# EAGLE schematic PCB_ROHM_BaAnh (EAGLE 9.6.2)
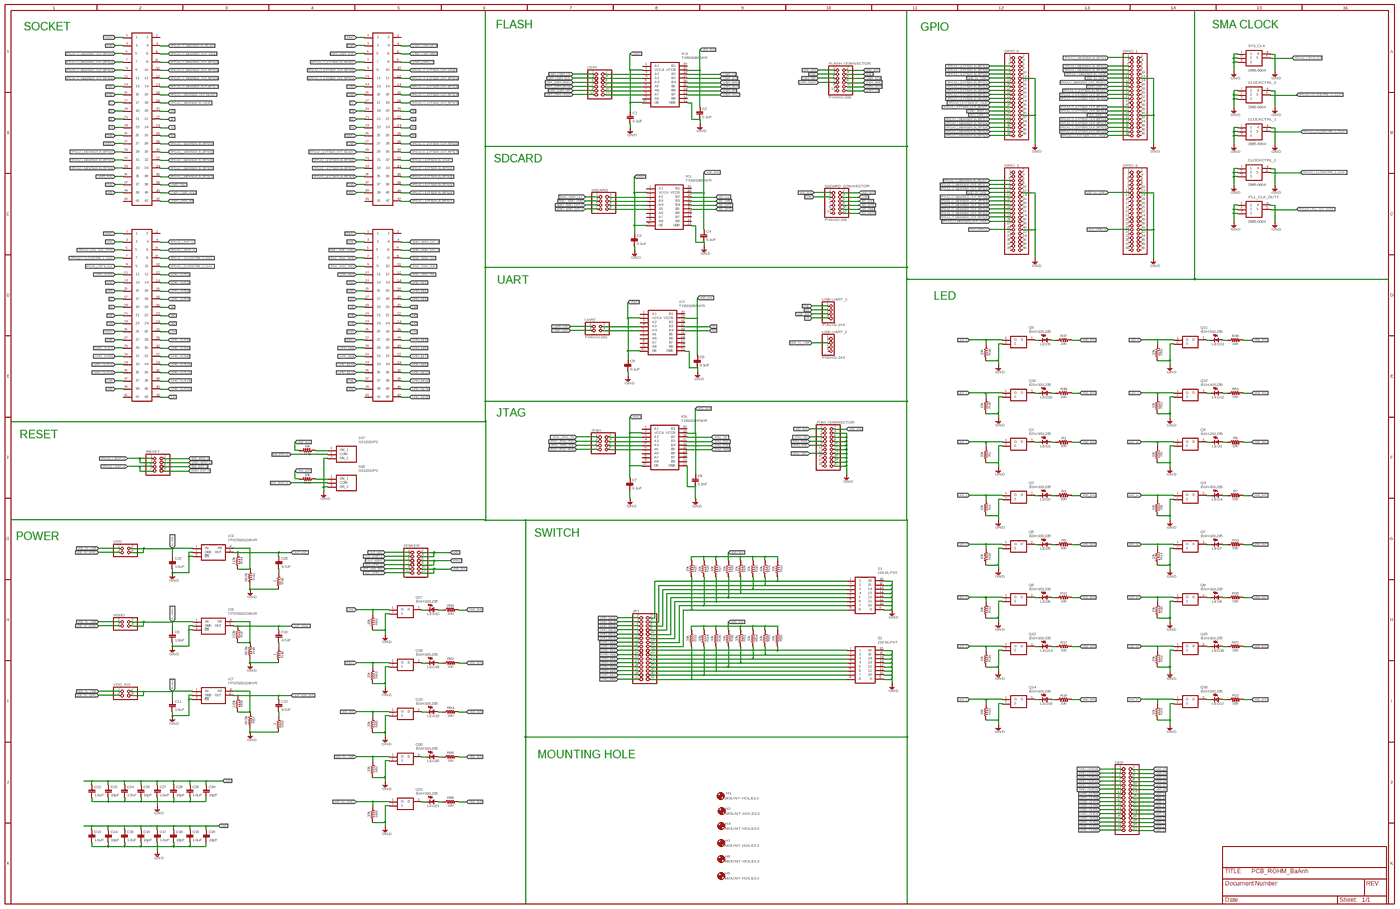
[diagram p0: schematic, sheet 1, overview]
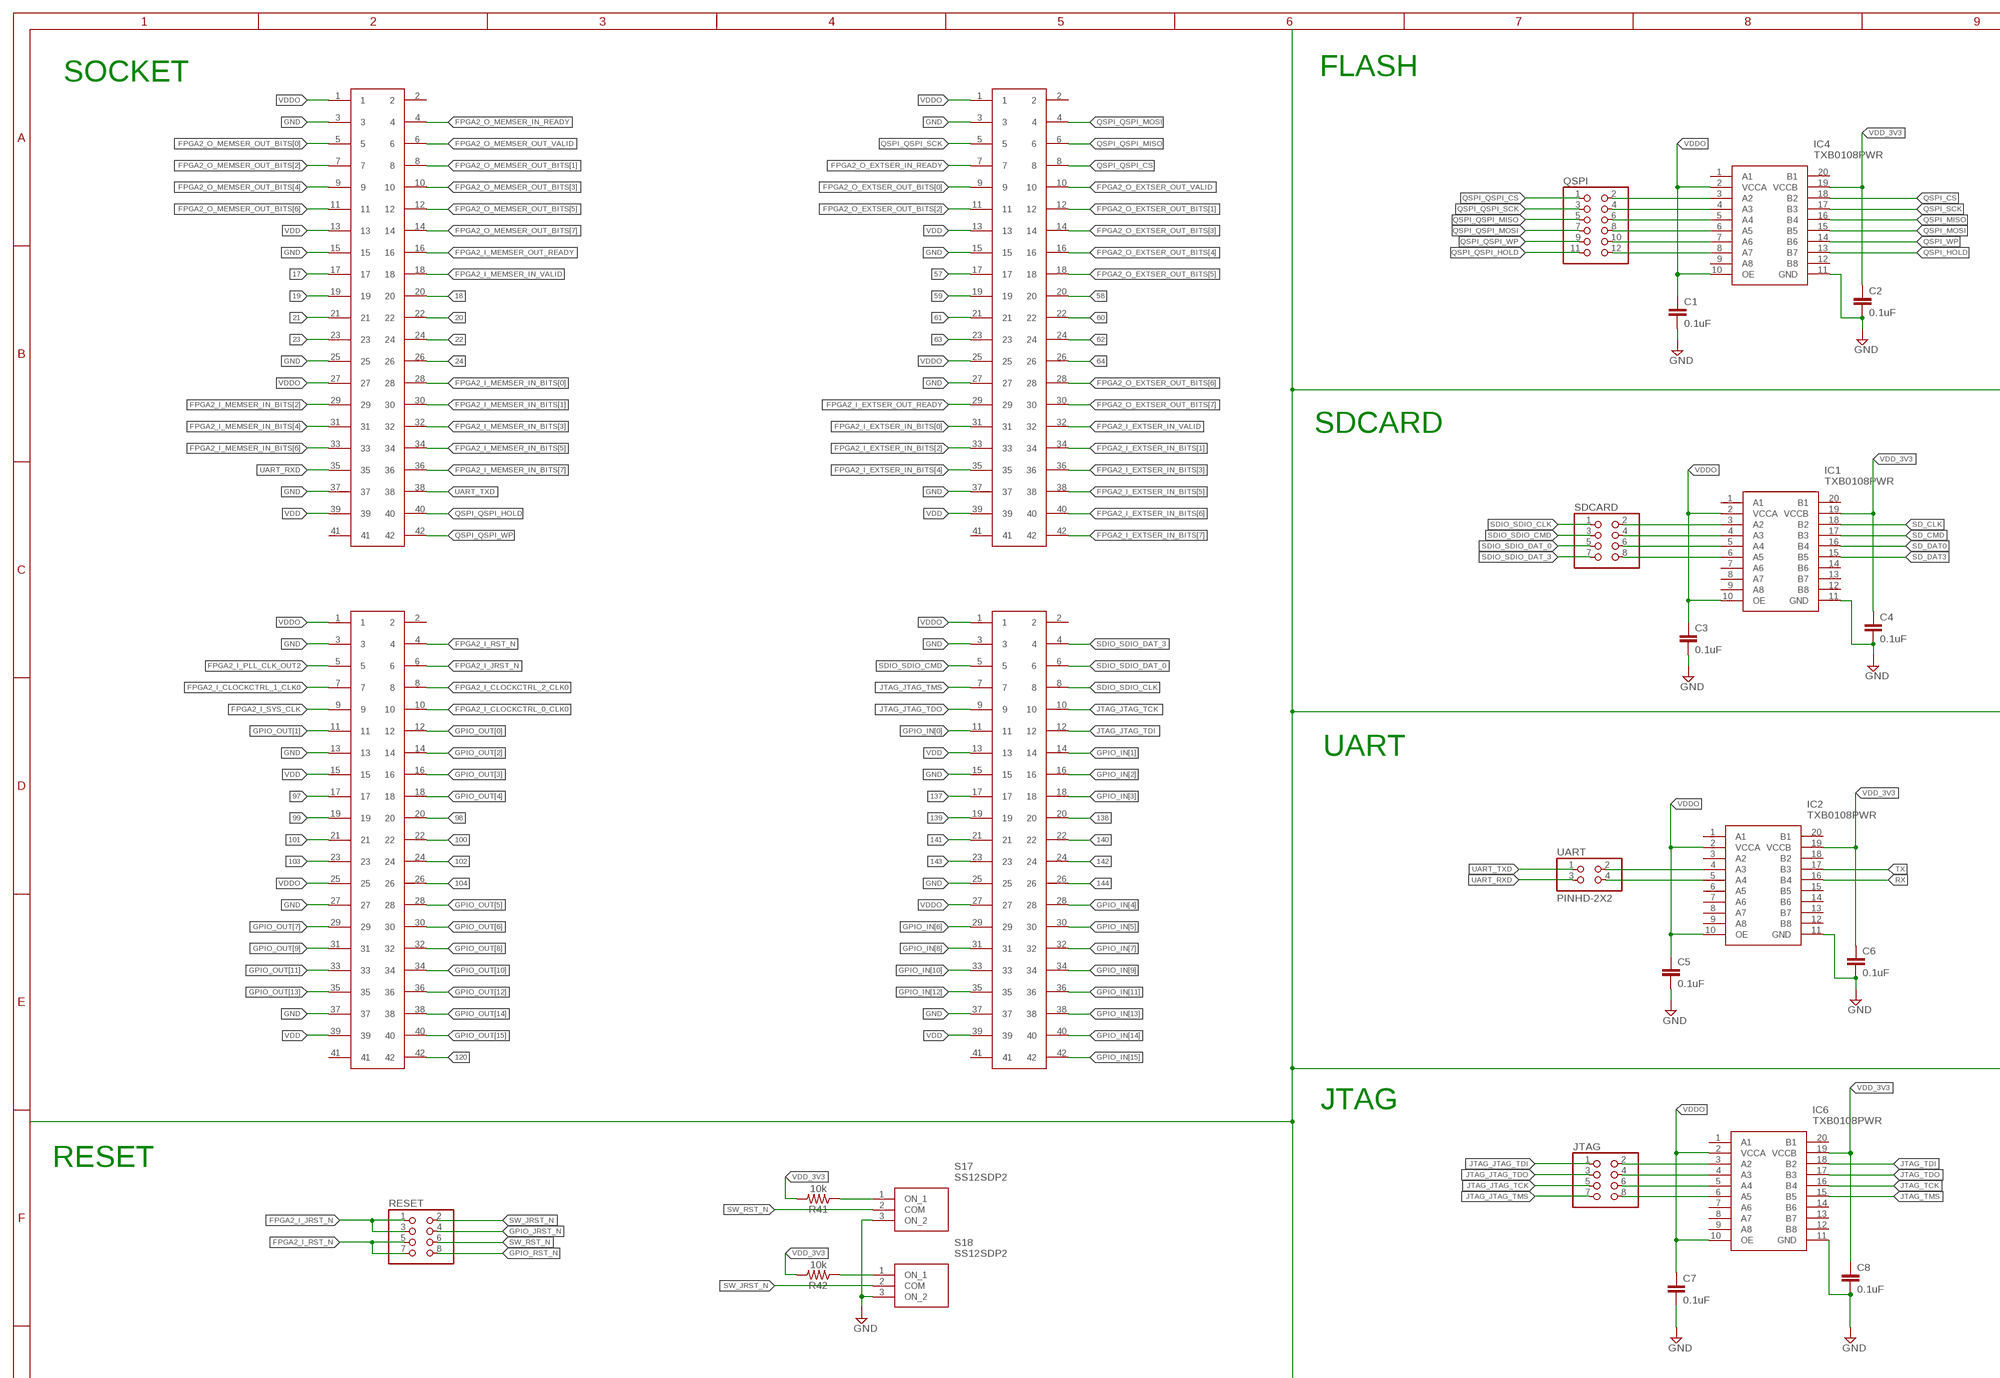
[diagram p1: schematic, sheet 1, part 1 of 4]
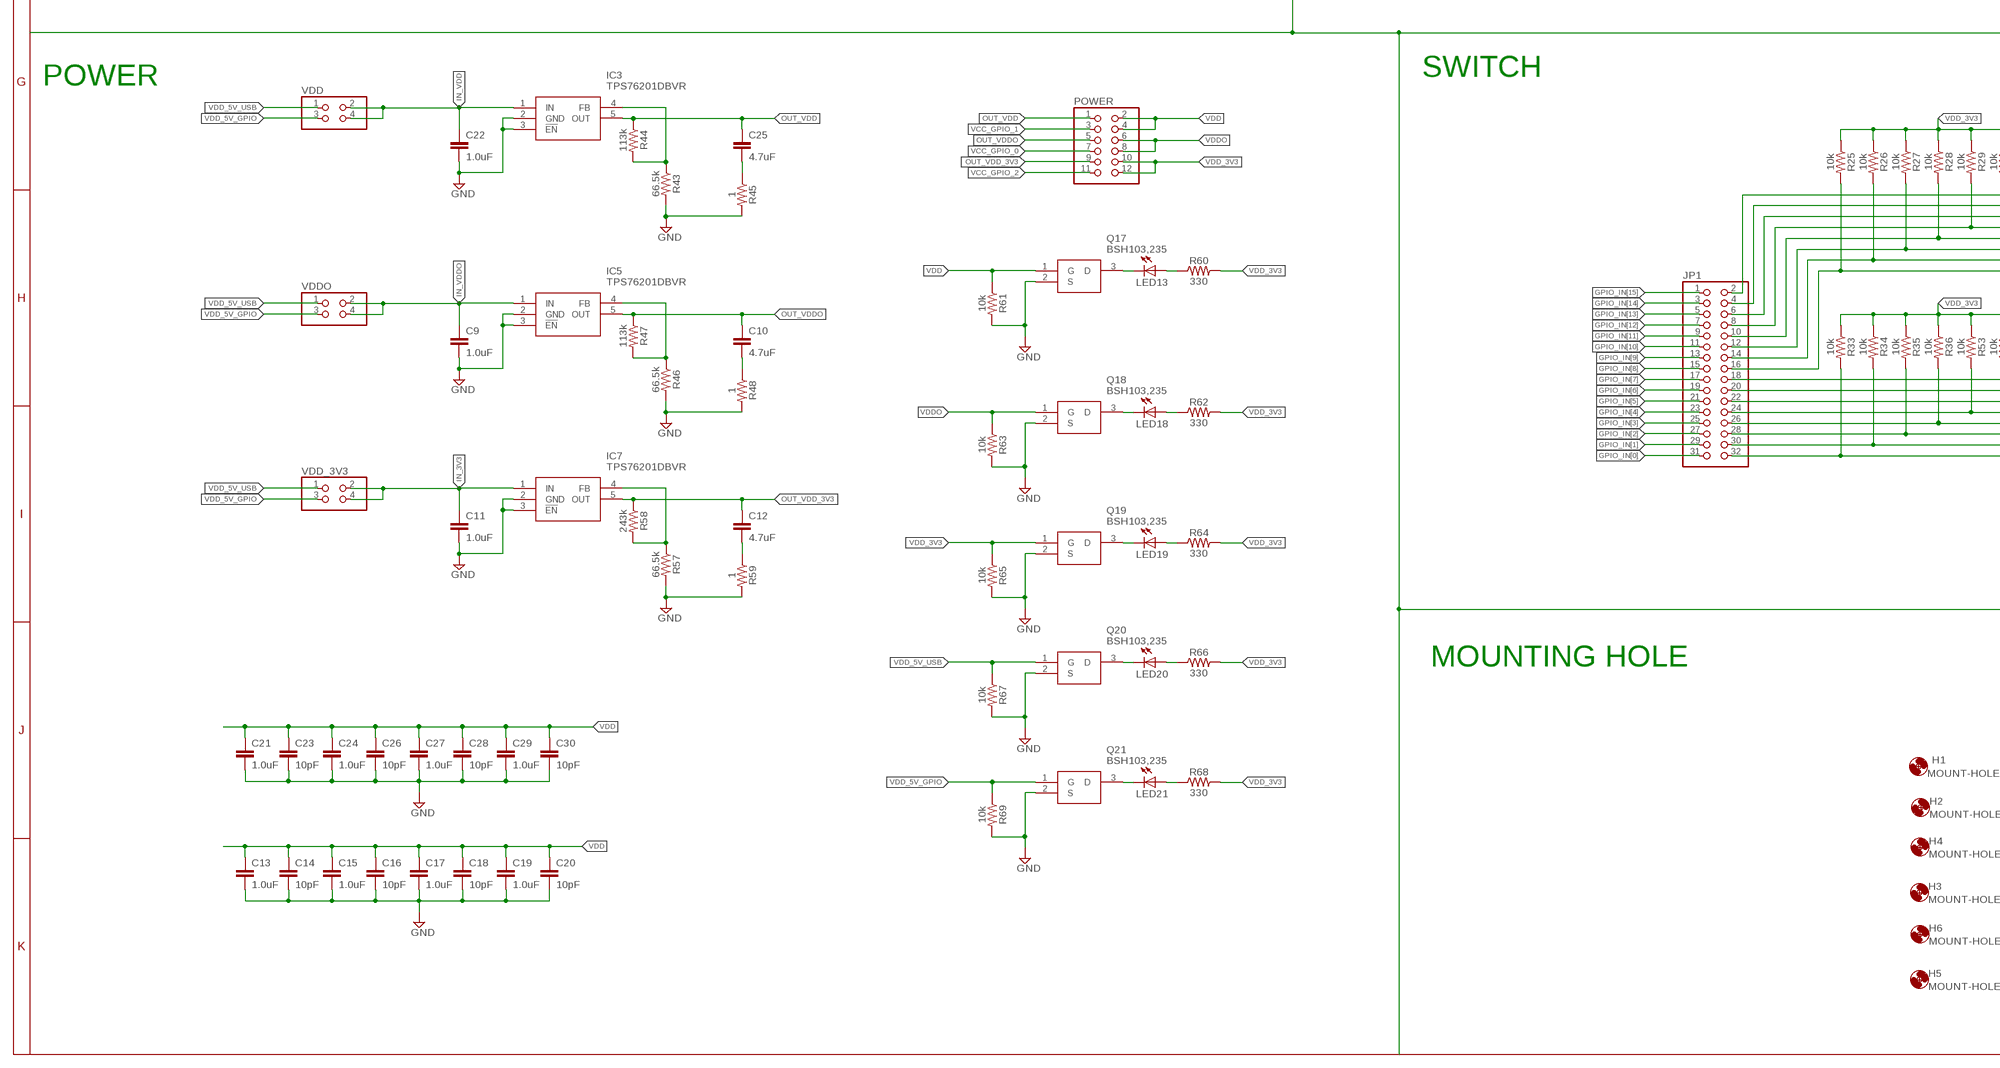
[diagram p2: schematic, sheet 1, part 2 of 4]
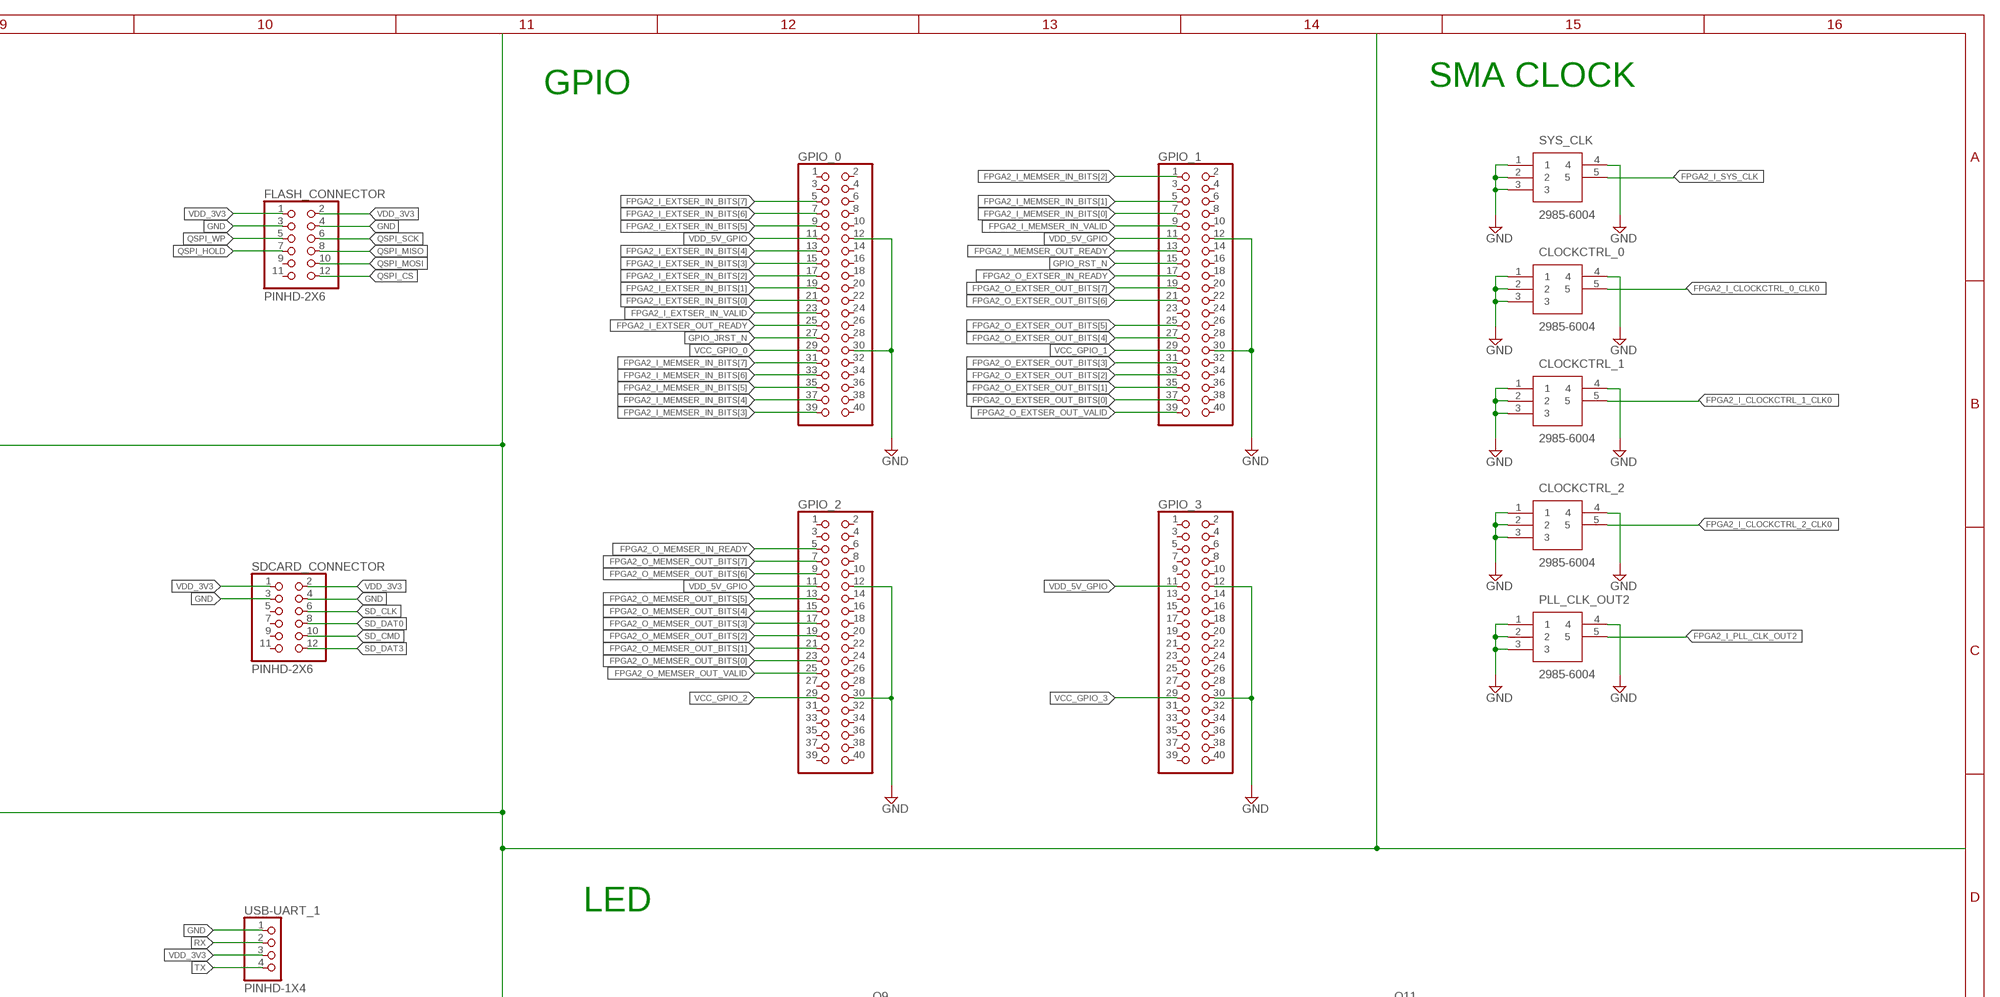
[diagram p3: schematic, sheet 1, part 3 of 4]
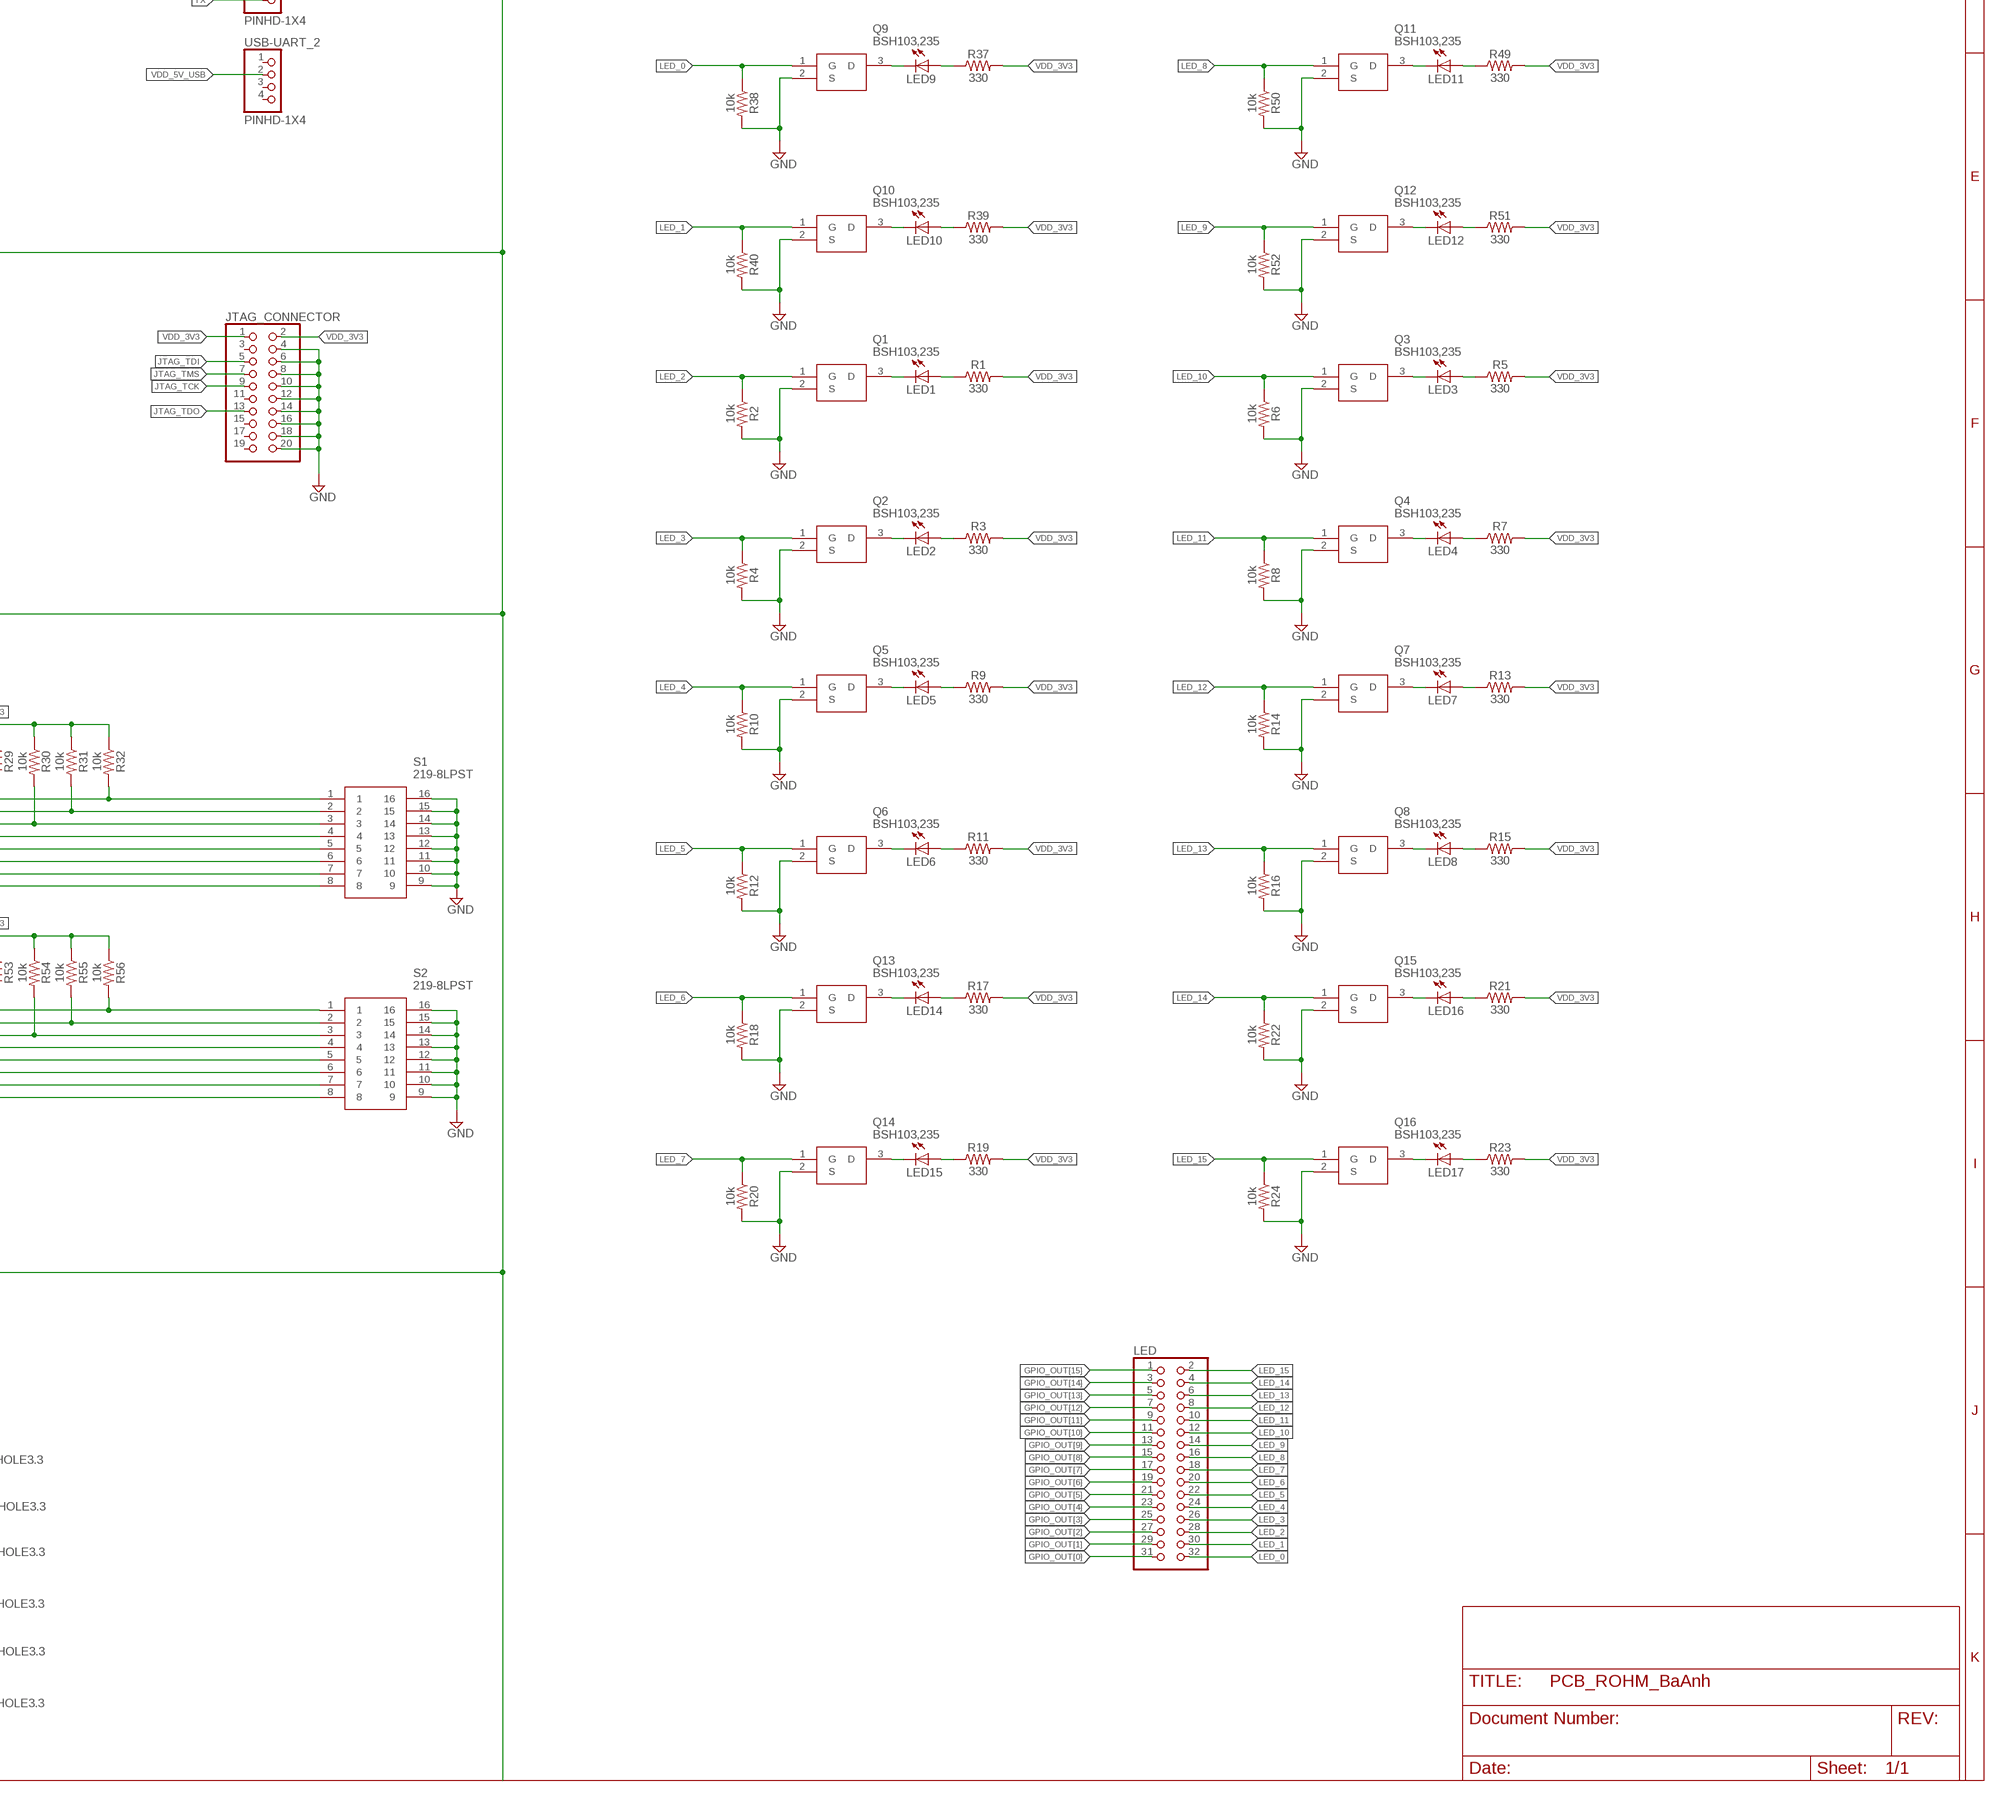
[diagram p4: schematic, sheet 1, part 4 of 4]

## Parts
C1  0.1uF  1.0UF-0805-25V-(+80/-20%)  [0805]
C2  0.1uF  1.0UF-0805-25V-(+80/-20%)  [0805]
C3  0.1uF  1.0UF-0805-25V-(+80/-20%)  [0805]
C4  0.1uF  1.0UF-0805-25V-(+80/-20%)  [0805]
C5  0.1uF  1.0UF-0805-25V-(+80/-20%)  [0805]
C6  0.1uF  1.0UF-0805-25V-(+80/-20%)  [0805]
C7  0.1uF  1.0UF-0805-25V-(+80/-20%)  [0805]
C8  0.1uF  1.0UF-0805-25V-(+80/-20%)  [0805]
C9  1.0uF  1.0UF-0805-25V-(+80/-20%)  [0805]
C10  4.7uF  1.0UF-0805-25V-(+80/-20%)  [0805]
C11  1.0uF  1.0UF-0805-25V-(+80/-20%)  [0805]
C12  4.7uF  1.0UF-0805-25V-(+80/-20%)  [0805]
C13  1.0uF  1.0UF-0805-25V-(+80/-20%)  [0805]
C14  10pF  1.0UF-0805-25V-(+80/-20%)  [0805]
C15  1.0uF  1.0UF-0805-25V-(+80/-20%)  [0805]
C16  10pF  1.0UF-0805-25V-(+80/-20%)  [0805]
C17  1.0uF  1.0UF-0805-25V-(+80/-20%)  [0805]
C18  10pF  1.0UF-0805-25V-(+80/-20%)  [0805]
C19  1.0uF  1.0UF-0805-25V-(+80/-20%)  [0805]
C20  10pF  1.0UF-0805-25V-(+80/-20%)  [0805]
C21  1.0uF  1.0UF-0805-25V-(+80/-20%)  [0805]
C22  1.0uF  1.0UF-0805-25V-(+80/-20%)  [0805]
C23  10pF  1.0UF-0805-25V-(+80/-20%)  [0805]
C24  1.0uF  1.0UF-0805-25V-(+80/-20%)  [0805]
C25  4.7uF  1.0UF-0805-25V-(+80/-20%)  [0805]
C26  10pF  1.0UF-0805-25V-(+80/-20%)  [0805]
C27  1.0uF  1.0UF-0805-25V-(+80/-20%)  [0805]
C28  10pF  1.0UF-0805-25V-(+80/-20%)  [0805]
C29  1.0uF  1.0UF-0805-25V-(+80/-20%)  [0805]
C30  10pF  1.0UF-0805-25V-(+80/-20%)  [0805]
CLOCKCTRL_0  2985-6004  [29856004]
CLOCKCTRL_1  2985-6004  [29856004]
CLOCKCTRL_2  2985-6004  [29856004]
FLASH_CONNECTOR  PINHD-2X6  [2X06]
GPIO_0  PINHD-2X20  [2X20]
GPIO_1  PINHD-2X20  [2X20]
GPIO_2  PINHD-2X20  [2X20]
GPIO_3  PINHD-2X20  [2X20]
H1  MOUNT-HOLE3.3  [3,3]
H2  MOUNT-HOLE3.3  [3,3]
H3  MOUNT-HOLE3.3  [3,3]
H4  MOUNT-HOLE3.3  [3,3]
H5  MOUNT-HOLE3.3  [3,3]
H6  MOUNT-HOLE3.3  [3,3]
IC1  TXB0108PWR  [SOP65P640X120-20N]
IC2  TXB0108PWR  [SOP65P640X120-20N]
IC3  TPS76201DBVR  [SOT95P280X145-5N]
IC4  TXB0108PWR  [SOP65P640X120-20N]
IC5  TPS76201DBVR  [SOT95P280X145-5N]
IC6  TXB0108PWR  [SOP65P640X120-20N]
IC7  TPS76201DBVR  [SOT95P280X145-5N]
JP1  PINHD-2X16  [2X16]
JTAG  PINHD-2X4  [2X04]
JTAG_CONNECTOR  PINHD-2X10  [2X10]
LED  PINHD-2X16  [2X16]
LED1  LEDCHIP-LED0805  [CHIP-LED0805]
LED2  LEDCHIP-LED0805  [CHIP-LED0805]
LED3  LEDCHIP-LED0805  [CHIP-LED0805]
LED4  LEDCHIP-LED0805  [CHIP-LED0805]
LED5  LEDCHIP-LED0805  [CHIP-LED0805]
LED6  LEDCHIP-LED0805  [CHIP-LED0805]
LED7  LEDCHIP-LED0805  [CHIP-LED0805]
LED8  LEDCHIP-LED0805  [CHIP-LED0805]
LED9  LEDCHIP-LED0805  [CHIP-LED0805]
LED10  LEDCHIP-LED0805  [CHIP-LED0805]
LED11  LEDCHIP-LED0805  [CHIP-LED0805]
LED12  LEDCHIP-LED0805  [CHIP-LED0805]
LED13  LEDCHIP-LED0805  [CHIP-LED0805]
LED14  LEDCHIP-LED0805  [CHIP-LED0805]
LED15  LEDCHIP-LED0805  [CHIP-LED0805]
LED16  LEDCHIP-LED0805  [CHIP-LED0805]
LED17  LEDCHIP-LED0805  [CHIP-LED0805]
LED18  LEDCHIP-LED0805  [CHIP-LED0805]
LED19  LEDCHIP-LED0805  [CHIP-LED0805]
LED20  LEDCHIP-LED0805  [CHIP-LED0805]
LED21  LEDCHIP-LED0805  [CHIP-LED0805]
PLL_CLK_OUT2  2985-6004  [29856004]
POWER  PINHD-2X6  [2X06]
Q1  BSH103,235  [SOT95P230X110-3N]
Q2  BSH103,235  [SOT95P230X110-3N]
Q3  BSH103,235  [SOT95P230X110-3N]
Q4  BSH103,235  [SOT95P230X110-3N]
Q5  BSH103,235  [SOT95P230X110-3N]
Q6  BSH103,235  [SOT95P230X110-3N]
Q7  BSH103,235  [SOT95P230X110-3N]
Q8  BSH103,235  [SOT95P230X110-3N]
Q9  BSH103,235  [SOT95P230X110-3N]
Q10  BSH103,235  [SOT95P230X110-3N]
Q11  BSH103,235  [SOT95P230X110-3N]
Q12  BSH103,235  [SOT95P230X110-3N]
Q13  BSH103,235  [SOT95P230X110-3N]
Q14  BSH103,235  [SOT95P230X110-3N]
Q15  BSH103,235  [SOT95P230X110-3N]
Q16  BSH103,235  [SOT95P230X110-3N]
Q17  BSH103,235  [SOT95P230X110-3N]
Q18  BSH103,235  [SOT95P230X110-3N]
Q19  BSH103,235  [SOT95P230X110-3N]
Q20  BSH103,235  [SOT95P230X110-3N]
Q21  BSH103,235  [SOT95P230X110-3N]
QSPI  PINHD-2X6  [2X06]
R1  330  0.3OHM-0805-1/8W-1%  [0805]
R2  10k  0.3OHM-0805-1/8W-1%  [0805]
R3  330  0.3OHM-0805-1/8W-1%  [0805]
R4  10k  0.3OHM-0805-1/8W-1%  [0805]
R5  330  0.3OHM-0805-1/8W-1%  [0805]
R6  10k  0.3OHM-0805-1/8W-1%  [0805]
R7  330  0.3OHM-0805-1/8W-1%  [0805]
R8  10k  0.3OHM-0805-1/8W-1%  [0805]
R9  330  0.3OHM-0805-1/8W-1%  [0805]
R10  10k  0.3OHM-0805-1/8W-1%  [0805]
R11  330  0.3OHM-0805-1/8W-1%  [0805]
R12  10k  0.3OHM-0805-1/8W-1%  [0805]
R13  330  0.3OHM-0805-1/8W-1%  [0805]
R14  10k  0.3OHM-0805-1/8W-1%  [0805]
R15  330  0.3OHM-0805-1/8W-1%  [0805]
R16  10k  0.3OHM-0805-1/8W-1%  [0805]
R17  330  0.3OHM-0805-1/8W-1%  [0805]
R18  10k  0.3OHM-0805-1/8W-1%  [0805]
R19  330  0.3OHM-0805-1/8W-1%  [0805]
R20  10k  0.3OHM-0805-1/8W-1%  [0805]
R21  330  0.3OHM-0805-1/8W-1%  [0805]
R22  10k  0.3OHM-0805-1/8W-1%  [0805]
R23  330  0.3OHM-0805-1/8W-1%  [0805]
R24  10k  0.3OHM-0805-1/8W-1%  [0805]
R25  10k  0.3OHM-0805-1/8W-1%  [0805]
R26  10k  0.3OHM-0805-1/8W-1%  [0805]
R27  10k  0.3OHM-0805-1/8W-1%  [0805]
R28  10k  0.3OHM-0805-1/8W-1%  [0805]
R29  10k  0.3OHM-0805-1/8W-1%  [0805]
R30  10k  0.3OHM-0805-1/8W-1%  [0805]
R31  10k  0.3OHM-0805-1/8W-1%  [0805]
R32  10k  0.3OHM-0805-1/8W-1%  [0805]
R33  10k  0.3OHM-0805-1/8W-1%  [0805]
R34  10k  0.3OHM-0805-1/8W-1%  [0805]
R35  10k  0.3OHM-0805-1/8W-1%  [0805]
R36  10k  0.3OHM-0805-1/8W-1%  [0805]
R37  330  0.3OHM-0805-1/8W-1%  [0805]
R38  10k  0.3OHM-0805-1/8W-1%  [0805]
R39  330  0.3OHM-0805-1/8W-1%  [0805]
R40  10k  0.3OHM-0805-1/8W-1%  [0805]
R41  10k  0.3OHM-0805-1/8W-1%  [0805]
R42  10k  0.3OHM-0805-1/8W-1%  [0805]
R43  66.5k  0.3OHM-0805-1/8W-1%  [0805]
R44  113k  0.3OHM-0805-1/8W-1%  [0805]
R45  1  0.3OHM-0805-1/8W-1%  [0805]
R46  66.5k  0.3OHM-0805-1/8W-1%  [0805]
R47  113k  0.3OHM-0805-1/8W-1%  [0805]
R48  1  0.3OHM-0805-1/8W-1%  [0805]
R49  330  0.3OHM-0805-1/8W-1%  [0805]
R50  10k  0.3OHM-0805-1/8W-1%  [0805]
R51  330  0.3OHM-0805-1/8W-1%  [0805]
R52  10k  0.3OHM-0805-1/8W-1%  [0805]
R53  10k  0.3OHM-0805-1/8W-1%  [0805]
R54  10k  0.3OHM-0805-1/8W-1%  [0805]
R55  10k  0.3OHM-0805-1/8W-1%  [0805]
R56  10k  0.3OHM-0805-1/8W-1%  [0805]
R57  66.5k  0.3OHM-0805-1/8W-1%  [0805]
R58  243k  0.3OHM-0805-1/8W-1%  [0805]
R59  1  0.3OHM-0805-1/8W-1%  [0805]
R60  330  0.3OHM-0805-1/8W-1%  [0805]
R61  10k  0.3OHM-0805-1/8W-1%  [0805]
R62  330  0.3OHM-0805-1/8W-1%  [0805]
R63  10k  0.3OHM-0805-1/8W-1%  [0805]
R64  330  0.3OHM-0805-1/8W-1%  [0805]
R65  10k  0.3OHM-0805-1/8W-1%  [0805]
R66  330  0.3OHM-0805-1/8W-1%  [0805]
R67  10k  0.3OHM-0805-1/8W-1%  [0805]
R68  330  0.3OHM-0805-1/8W-1%  [0805]
R69  10k  0.3OHM-0805-1/8W-1%  [0805]
RESET  PINHD-2X4  [2X04]
S1  219-8LPST  [2198LPST]
S2  219-8LPST  [2198LPST]
S17  SS12SDP2  [SS12SDP2]
S18  SS12SDP2  [SS12SDP2]
SDCARD  PINHD-2X4  [2X04]
SDCARD_CONNECTOR  PINHD-2X6  [2X06]
SYS_CLK  2985-6004  [29856004]
U$1  2X41_HEADER  [2X41_HEADER]
U$2  2X41_HEADER  [2X41_HEADER]
U$3  2X41_HEADER  [2X41_HEADER]
U$4  2X41_HEADER  [2X41_HEADER]
UART  PINHD-2X2  [2X02]
USB-UART_1  PINHD-1X4  [1X04]
USB-UART_2  PINHD-1X4  [1X04]
VDD  PINHD-2X2  [2X02]
VDD_3V3  PINHD-2X2  [2X02]
VDDO  PINHD-2X2  [2X02]

## Nets
17: U$1.17
18: U$1.20
19: U$1.19
20: U$1.22
21: U$1.21
22: U$1.24
23: U$1.23
24: U$1.26
57: U$2.17
58: U$2.20
59: U$2.19
60: U$2.22
61: U$2.21
62: U$2.24
63: U$2.23
64: U$2.26
97: U$3.17
98: U$3.20
99: U$3.19
100: U$3.22
101: U$3.21
102: U$3.24
103: U$3.23
104: U$3.26
120: U$3.42
137: U$4.17
138: U$4.20
139: U$4.19
140: U$4.22
141: U$4.21
142: U$4.24
143: U$4.23
144: U$4.26
FPGA2_I_CLOCKCTRL_0_CLK0: CLOCKCTRL_0.5 U$3.10
FPGA2_I_CLOCKCTRL_1_CLK0: CLOCKCTRL_1.5 U$3.7
FPGA2_I_CLOCKCTRL_2_CLK0: CLOCKCTRL_2.5 U$3.8
FPGA2_I_EXTSER_IN_BITS[0]: GPIO_0.21 U$2.31
FPGA2_I_EXTSER_IN_BITS[1]: GPIO_0.19 U$2.34
FPGA2_I_EXTSER_IN_BITS[2]: GPIO_0.17 U$2.33
FPGA2_I_EXTSER_IN_BITS[3]: GPIO_0.15 U$2.36
FPGA2_I_EXTSER_IN_BITS[4]: GPIO_0.13 U$2.35
FPGA2_I_EXTSER_IN_BITS[5]: GPIO_0.9 U$2.38
FPGA2_I_EXTSER_IN_BITS[6]: GPIO_0.7 U$2.40
FPGA2_I_EXTSER_IN_BITS[7]: GPIO_0.5 U$2.42
FPGA2_I_EXTSER_IN_VALID: GPIO_0.23 U$2.32
FPGA2_I_EXTSER_OUT_READY: GPIO_0.25 U$2.29
FPGA2_I_JRST_N: RESET.1 RESET.3 U$3.6
FPGA2_I_MEMSER_IN_BITS[0]: GPIO_1.7 U$1.28
FPGA2_I_MEMSER_IN_BITS[1]: GPIO_1.5 U$1.30
FPGA2_I_MEMSER_IN_BITS[2]: GPIO_1.1 U$1.29
FPGA2_I_MEMSER_IN_BITS[3]: GPIO_0.39 U$1.32
FPGA2_I_MEMSER_IN_BITS[4]: GPIO_0.37 U$1.31
FPGA2_I_MEMSER_IN_BITS[5]: GPIO_0.35 U$1.34
FPGA2_I_MEMSER_IN_BITS[6]: GPIO_0.33 U$1.33
FPGA2_I_MEMSER_IN_BITS[7]: GPIO_0.31 U$1.36
FPGA2_I_MEMSER_IN_VALID: GPIO_1.9 U$1.18
FPGA2_I_MEMSER_OUT_READY: GPIO_1.13 U$1.16
FPGA2_I_PLL_CLK_OUT2: PLL_CLK_OUT2.5 U$3.5
FPGA2_I_RST_N: RESET.5 RESET.7 U$3.4
FPGA2_I_SYS_CLK: SYS_CLK.5 U$3.9
FPGA2_O_EXTSER_IN_READY: GPIO_1.17 U$2.7
FPGA2_O_EXTSER_OUT_BITS[0]: GPIO_1.37 U$2.9
FPGA2_O_EXTSER_OUT_BITS[1]: GPIO_1.35 U$2.12
FPGA2_O_EXTSER_OUT_BITS[2]: GPIO_1.33 U$2.11
FPGA2_O_EXTSER_OUT_BITS[3]: GPIO_1.31 U$2.14
FPGA2_O_EXTSER_OUT_BITS[4]: GPIO_1.27 U$2.16
FPGA2_O_EXTSER_OUT_BITS[5]: GPIO_1.25 U$2.18
FPGA2_O_EXTSER_OUT_BITS[6]: GPIO_1.21 U$2.28
FPGA2_O_EXTSER_OUT_BITS[7]: GPIO_1.19 U$2.30
FPGA2_O_EXTSER_OUT_VALID: GPIO_1.39 U$2.10
FPGA2_O_MEMSER_IN_READY: GPIO_2.5 U$1.4
FPGA2_O_MEMSER_OUT_BITS[0]: GPIO_2.23 U$1.5
FPGA2_O_MEMSER_OUT_BITS[1]: GPIO_2.21 U$1.8
FPGA2_O_MEMSER_OUT_BITS[2]: GPIO_2.19 U$1.7
FPGA2_O_MEMSER_OUT_BITS[3]: GPIO_2.17 U$1.10
FPGA2_O_MEMSER_OUT_BITS[4]: GPIO_2.15 U$1.9
FPGA2_O_MEMSER_OUT_BITS[5]: GPIO_2.13 U$1.12
FPGA2_O_MEMSER_OUT_BITS[6]: GPIO_2.9 U$1.11
FPGA2_O_MEMSER_OUT_BITS[7]: GPIO_2.7 U$1.14
FPGA2_O_MEMSER_OUT_VALID: GPIO_2.25 U$1.6
GND: C1.2 C2.2 C3.2 C4.2 C5.2 C6.2 C7.2 C8.2 C9.2 C11.2 C13.2 C14.2 C15.2 C16.2 C17.2 C18.2 C19.2 C20.2 C21.2 C22.2 C23.2 C24.2 C26.2 C27.2 C28.2 C29.2 C30.2 CLOCKCTRL_0.1 CLOCKCTRL_0.2 CLOCKCTRL_0.3 CLOCKCTRL_0.4 CLOCKCTRL_1.1 CLOCKCTRL_1.2 CLOCKCTRL_1.3 CLOCKCTRL_1.4 CLOCKCTRL_2.1 CLOCKCTRL_2.2 CLOCKCTRL_2.3 CLOCKCTRL_2.4 FLASH_CONNECTOR.3 FLASH_CONNECTOR.4 GPIO_0.12 GPIO_0.30 GPIO_1.12 GPIO_1.30 GPIO_2.12 GPIO_2.30 GPIO_3.12 GPIO_3.30 IC1.11(GND) IC2.11(GND) IC3.2(GND) IC3.3(!EN) IC4.11(GND) IC5.2(GND) IC5.3(!EN) IC6.11(GND) IC7.2(GND) IC7.3(!EN) JTAG_CONNECTOR.4 JTAG_CONNECTOR.6 JTAG_CONNECTOR.8 JTAG_CONNECTOR.10 JTAG_CONNECTOR.12 JTAG_CONNECTOR.14 JTAG_CONNECTOR.16 JTAG_CONNECTOR.18 JTAG_CONNECTOR.20 PLL_CLK_OUT2.1 PLL_CLK_OUT2.2 PLL_CLK_OUT2.3 PLL_CLK_OUT2.4 Q1.2(S) Q2.2(S) Q3.2(S) Q4.2(S) Q5.2(S) Q6.2(S) Q7.2(S) Q8.2(S) Q9.2(S) Q10.2(S) Q11.2(S) Q12.2(S) Q13.2(S) Q14.2(S) Q15.2(S) Q16.2(S) Q17.2(S) Q18.2(S) Q19.2(S) Q20.2(S) Q21.2(S) R2.2 R4.2 R6.2 R8.2 R10.2 R12.2 R14.2 R16.2 R18.2 R20.2 R22.2 R24.2 R38.2 R40.2 R43.2 R45.2 R46.2 R48.2 R50.2 R52.2 R57.2 R59.2 R61.2 R63.2 R65.2 R67.2 R69.2 S1.9 S1.10 S1.11 S1.12 S1.13 S1.14 S1.15 S1.16 S2.9 S2.10 S2.11 S2.12 S2.13 S2.14 S2.15 S2.16 S17.3(ON_2) S18.3(ON_2) SDCARD_CONNECTOR.3 SDCARD_CONNECTOR.4 SYS_CLK.1 SYS_CLK.2 SYS_CLK.3 SYS_CLK.4 U$1.3 U$1.15 U$1.25 U$1.37 U$2.3 U$2.15 U$2.27 U$2.37 U$3.3 U$3.13 U$3.27 U$3.37 U$4.3 U$4.15 U$4.25 U$4.37 USB-UART_1.1
GPIO_IN[0]: JP1.31 U$4.11
GPIO_IN[1]: JP1.29 U$4.14
GPIO_IN[2]: JP1.27 U$4.16
GPIO_IN[3]: JP1.25 U$4.18
GPIO_IN[4]: JP1.23 U$4.28
GPIO_IN[5]: JP1.21 U$4.30
GPIO_IN[6]: JP1.19 U$4.29
GPIO_IN[7]: JP1.17 U$4.32
GPIO_IN[8]: JP1.15 U$4.31
GPIO_IN[9]: JP1.13 U$4.34
GPIO_IN[10]: JP1.11 U$4.33
GPIO_IN[11]: JP1.9 U$4.36
GPIO_IN[12]: JP1.7 U$4.35
GPIO_IN[13]: JP1.5 U$4.38
GPIO_IN[14]: JP1.3 U$4.40
GPIO_IN[15]: JP1.1 U$4.42
GPIO_JRST_N: GPIO_0.27 RESET.4
GPIO_OUT[0]: LED.31 U$3.12
GPIO_OUT[1]: LED.29 U$3.11
GPIO_OUT[2]: LED.27 U$3.14
GPIO_OUT[3]: LED.25 U$3.16
GPIO_OUT[4]: LED.23 U$3.18
GPIO_OUT[5]: LED.21 U$3.28
GPIO_OUT[6]: LED.19 U$3.30
GPIO_OUT[7]: LED.17 U$3.29
GPIO_OUT[8]: LED.15 U$3.32
GPIO_OUT[9]: LED.13 U$3.31
GPIO_OUT[10]: LED.11 U$3.34
GPIO_OUT[11]: LED.9 U$3.33
GPIO_OUT[12]: LED.7 U$3.36
GPIO_OUT[13]: LED.5 U$3.35
GPIO_OUT[14]: LED.3 U$3.38
GPIO_OUT[15]: LED.1 U$3.40
GPIO_RST_N: GPIO_1.15 RESET.8
IN_3V3: C11.1 IC7.1(IN) VDD_3V3.2 VDD_3V3.4
IN_VDD: C22.1 IC3.1(IN) VDD.2 VDD.4
IN_VDDO: C9.1 IC5.1(IN) VDDO.2 VDDO.4
JTAG_JTAG_TCK: JTAG.5 U$4.10
JTAG_JTAG_TDI: JTAG.1 U$4.12
JTAG_JTAG_TDO: JTAG.3 U$4.9
JTAG_JTAG_TMS: JTAG.7 U$4.7
JTAG_TCK: IC6.16(B4) JTAG_CONNECTOR.9
JTAG_TDI: IC6.18(B2) JTAG_CONNECTOR.5
JTAG_TDO: IC6.17(B3) JTAG_CONNECTOR.13
JTAG_TMS: IC6.15(B5) JTAG_CONNECTOR.7
LED_0: LED.32 Q9.1(G) R38.1
LED_1: LED.30 Q10.1(G) R40.1
LED_2: LED.28 Q1.1(G) R2.1
LED_3: LED.26 Q2.1(G) R4.1
LED_4: LED.24 Q5.1(G) R10.1
LED_5: LED.22 Q6.1(G) R12.1
LED_6: LED.20 Q13.1(G) R18.1
LED_7: LED.18 Q14.1(G) R20.1
LED_8: LED.16 Q11.1(G) R50.1
LED_9: LED.14 Q12.1(G) R52.1
LED_10: LED.12 Q3.1(G) R6.1
LED_11: LED.10 Q4.1(G) R8.1
LED_12: LED.8 Q7.1(G) R14.1
LED_13: LED.6 Q8.1(G) R16.1
LED_14: LED.4 Q15.1(G) R22.1
LED_15: LED.2 Q16.1(G) R24.1
N$1: IC1.3(A2) SDCARD.2
N$2: IC1.4(A3) SDCARD.4
N$3: IC1.5(A4) SDCARD.6
N$4: IC1.6(A5) SDCARD.8
N$5: IC6.3(A2) JTAG.2
N$6: IC2.4(A3) UART.2
N$7: IC2.5(A4) UART.4
N$8: IC6.4(A3) JTAG.4
N$9: IC6.5(A4) JTAG.6
N$10: IC6.6(A5) JTAG.8
N$11: R41.1 S17.1(ON_1)
N$12: LED1.C Q1.3(D)
N$13: LED1.A R1.1
N$14: LED2.C Q2.3(D)
N$15: LED9.C Q9.3(D)
N$16: LED9.A R37.1
N$17: LED2.A R3.1
N$18: LED3.C Q3.3(D)
N$19: LED3.A R5.1
N$20: LED4.C Q4.3(D)
N$21: LED4.A R7.1
N$22: LED5.C Q5.3(D)
N$23: LED5.A R9.1
N$24: LED6.C Q6.3(D)
N$25: LED6.A R11.1
N$26: LED7.C Q7.3(D)
N$27: LED7.A R13.1
N$28: LED8.C Q8.3(D)
N$29: IC4.3(A2) QSPI.2
N$30: LED10.C Q10.3(D)
N$31: LED8.A R15.1
N$32: LED14.C Q13.3(D)
N$33: LED10.A R39.1
N$34: LED14.A R17.1
N$35: IC4.4(A3) QSPI.4
N$36: LED15.C Q14.3(D)
N$37: IC4.5(A4) QSPI.6
N$38: IC4.6(A5) QSPI.8
N$39: LED15.A R19.1
N$40: LED16.C Q15.3(D)
N$41: LED16.A R21.1
N$42: LED17.C Q16.3(D)
N$43: LED17.A R23.1
N$44: R42.1 S18.1(ON_1)
N$45: IC3.4(FB) R43.1 R44.2
N$46: C25.2 R45.1
N$47: IC5.4(FB) R46.1 R47.2
N$48: JP1.32 R33.2 S2.8
N$49: JP1.30 R34.2 S2.7
N$50: JP1.28 R35.2 S2.6
N$51: JP1.26 R36.2 S2.5
N$52: C10.2 R48.1
N$53: IC7.4(FB) R57.1 R58.2
N$54: C12.2 R59.1
N$55: LED13.C Q17.3(D)
N$56: JP1.24 R53.2 S2.4
N$57: JP1.22 R54.2 S2.3
N$58: JP1.20 R55.2 S2.2
N$59: LED11.C Q11.3(D)
N$60: JP1.18 R56.2 S2.1
N$61: LED11.A R49.1
N$62: LED13.A R60.1
N$63: LED12.C Q12.3(D)
N$64: LED12.A R51.1
N$65: LED18.C Q18.3(D)
N$66: JP1.16 R25.2 S1.8
N$67: JP1.14 R26.2 S1.7
N$68: JP1.12 R27.2 S1.6
N$69: JP1.10 R28.2 S1.5
N$70: LED18.A R62.1
N$71: LED19.C Q19.3(D)
N$72: JP1.8 R29.2 S1.4
N$73: JP1.6 R30.2 S1.3
N$74: JP1.4 R31.2 S1.2
N$75: JP1.2 R32.2 S1.1
N$76: LED19.A R64.1
N$77: LED20.C Q20.3(D)
N$78: LED20.A R66.1
N$79: LED21.C Q21.3(D)
N$80: IC4.7(A6) QSPI.10
N$81: IC4.8(A7) QSPI.12
N$82: LED21.A R68.1
OUT_VDD: C25.1 IC3.5(OUT) POWER.1 R44.1
OUT_VDD_3V3: C12.1 IC7.5(OUT) POWER.9 R58.1
OUT_VDDO: C10.1 IC5.5(OUT) POWER.5 R47.1
QSPI_CS: FLASH_CONNECTOR.12 IC4.18(B2)
QSPI_HOLD: FLASH_CONNECTOR.7 IC4.13(B7)
QSPI_MISO: FLASH_CONNECTOR.8 IC4.16(B4)
QSPI_MOSI: FLASH_CONNECTOR.10 IC4.15(B5)
QSPI_QSPI_CS: QSPI.1 U$2.8
QSPI_QSPI_HOLD: QSPI.11 U$1.40
QSPI_QSPI_MISO: QSPI.5 U$2.6
QSPI_QSPI_MOSI: QSPI.7 U$2.4
QSPI_QSPI_SCK: QSPI.3 U$2.5
QSPI_QSPI_WP: QSPI.9 U$1.42
QSPI_SCK: FLASH_CONNECTOR.6 IC4.17(B3)
QSPI_WP: FLASH_CONNECTOR.5 IC4.14(B6)
RX: IC2.16(B4) USB-UART_1.2
SD_CLK: IC1.18(B2) SDCARD_CONNECTOR.6
SD_CMD: IC1.17(B3) SDCARD_CONNECTOR.10
SD_DAT0: IC1.16(B4) SDCARD_CONNECTOR.8
SD_DAT3: IC1.15(B5) SDCARD_CONNECTOR.12
SDIO_SDIO_CLK: SDCARD.1 U$4.8
SDIO_SDIO_CMD: SDCARD.3 U$4.5
SDIO_SDIO_DAT_0: SDCARD.5 U$4.6
SDIO_SDIO_DAT_3: SDCARD.7 U$4.4
SW_JRST_N: RESET.2 S18.2(COM)
SW_RST_N: RESET.6 S17.2(COM)
TX: IC2.17(B3) USB-UART_1.4
UART_RXD: U$1.35 UART.3
UART_TXD: U$1.38 UART.1
VCC_GPIO_0: GPIO_0.29 POWER.7
VCC_GPIO_1: GPIO_1.29 POWER.3
VCC_GPIO_2: GPIO_2.29 POWER.11
VCC_GPIO_3: GPIO_3.29
VDD: C13.1 C14.1 C15.1 C16.1 C17.1 C18.1 C19.1 C20.1 C21.1 C23.1 C24.1 C26.1 C27.1 C28.1 C29.1 C30.1 POWER.2 POWER.4 Q17.1(G) R61.1 U$1.13 U$1.39 U$2.13 U$2.39 U$3.15 U$3.39 U$4.13 U$4.39
VDD_3V3: C2.1 C4.1 C6.1 C8.1 FLASH_CONNECTOR.1 FLASH_CONNECTOR.2 IC1.19(VCCB) IC2.19(VCCB) IC4.19(VCCB) IC6.19(VCCB) JTAG_CONNECTOR.1 JTAG_CONNECTOR.2 POWER.10 POWER.12 Q19.1(G) R1.2 R3.2 R5.2 R7.2 R9.2 R11.2 R13.2 R15.2 R17.2 R19.2 R21.2 R23.2 R25.1 R26.1 R27.1 R28.1 R29.1 R30.1 R31.1 R32.1 R33.1 R34.1 R35.1 R36.1 R37.2 R39.2 R41.2 R42.2 R49.2 R51.2 R53.1 R54.1 R55.1 R56.1 R60.2 R62.2 R64.2 R65.1 R66.2 R68.2 SDCARD_CONNECTOR.1 SDCARD_CONNECTOR.2 USB-UART_1.3
VDD_5V_GPIO: GPIO_0.11 GPIO_1.11 GPIO_2.11 GPIO_3.11 Q21.1(G) R69.1 VDD.3 VDD_3V3.3 VDDO.3
VDD_5V_USB: Q20.1(G) R67.1 USB-UART_2.2 VDD.1 VDD_3V3.1 VDDO.1
VDDO: C1.1 C3.1 C5.1 C7.1 IC1.2(VCCA) IC1.10(OE) IC2.2(VCCA) IC2.10(OE) IC4.2(VCCA) IC4.10(OE) IC6.2(VCCA) IC6.10(OE) POWER.6 POWER.8 Q18.1(G) R63.1 U$1.1 U$1.27 U$2.1 U$2.25 U$3.1 U$3.25 U$4.1 U$4.27
Unconnected: FLASH_CONNECTOR.9 FLASH_CONNECTOR.11 GPIO_0.1 GPIO_0.2 GPIO_0.3 GPIO_0.4 GPIO_0.6 GPIO_0.8 GPIO_0.10 GPIO_0.14 GPIO_0.16 GPIO_0.18 GPIO_0.20 GPIO_0.22 GPIO_0.24 GPIO_0.26 GPIO_0.28 GPIO_0.32 GPIO_0.34 GPIO_0.36 GPIO_0.38 GPIO_0.40 GPIO_1.2 GPIO_1.3 GPIO_1.4 GPIO_1.6 GPIO_1.8 GPIO_1.10 GPIO_1.14 GPIO_1.16 GPIO_1.18 GPIO_1.20 GPIO_1.22 GPIO_1.23 GPIO_1.24 GPIO_1.26 GPIO_1.28 GPIO_1.32 GPIO_1.34 GPIO_1.36 GPIO_1.38 GPIO_1.40 GPIO_2.1 GPIO_2.2 GPIO_2.3 GPIO_2.4 GPIO_2.6 GPIO_2.8 GPIO_2.10 GPIO_2.14 GPIO_2.16 GPIO_2.18 GPIO_2.20 GPIO_2.22 GPIO_2.24 GPIO_2.26 GPIO_2.27 GPIO_2.28 GPIO_2.31 GPIO_2.32 GPIO_2.33 GPIO_2.34 GPIO_2.35 GPIO_2.36 GPIO_2.37 GPIO_2.38 GPIO_2.39 GPIO_2.40 GPIO_3.1 GPIO_3.2 GPIO_3.3 GPIO_3.4 GPIO_3.5 GPIO_3.6 GPIO_3.7 GPIO_3.8 GPIO_3.9 GPIO_3.10 GPIO_3.13 GPIO_3.14 GPIO_3.15 GPIO_3.16 GPIO_3.17 GPIO_3.18 GPIO_3.19 GPIO_3.20 GPIO_3.21 GPIO_3.22 GPIO_3.23 GPIO_3.24 GPIO_3.25 GPIO_3.26 GPIO_3.27 GPIO_3.28 GPIO_3.31 GPIO_3.32 GPIO_3.33 GPIO_3.34 GPIO_3.35 GPIO_3.36 GPIO_3.37 GPIO_3.38 GPIO_3.39 GPIO_3.40 IC1.1(A1) IC1.7(A6) IC1.8(A7) IC1.9(A8) IC1.12(B8) IC1.13(B7) IC1.14(B6) IC1.20(B1) IC2.1(A1) IC2.3(A2) IC2.6(A5) IC2.7(A6) IC2.8(A7) IC2.9(A8) IC2.12(B8) IC2.13(B7) IC2.14(B6) IC2.15(B5) IC2.18(B2) IC2.20(B1) IC4.1(A1) IC4.9(A8) IC4.12(B8) IC4.20(B1) IC6.1(A1) IC6.7(A6) IC6.8(A7) IC6.9(A8) IC6.12(B8) IC6.13(B7) IC6.14(B6) IC6.20(B1) JTAG_CONNECTOR.3 JTAG_CONNECTOR.11 JTAG_CONNECTOR.15 JTAG_CONNECTOR.17 JTAG_CONNECTOR.19 SDCARD_CONNECTOR.5 SDCARD_CONNECTOR.7 SDCARD_CONNECTOR.9 SDCARD_CONNECTOR.11 U$1.2 U$1.41 U$2.2 U$2.41 U$3.2 U$3.41 U$4.2 U$4.41 USB-UART_2.1 USB-UART_2.3 USB-UART_2.4

## Notes on the sheet
- SOCKET | FLASH | GPIO | SMA CLOCK
- SDCARD
- UART
- LED
- JTAG
- RESET
- POWER | SWITCH
- MOUNTING HOLE

## Library data of the parts
C1-C8 C10 C12 C14 C16 C18 C20 C23 C25 C26 C28 C30 = SparkFun-Capacitors:1.0UF: 1µF ceramic capacitors A capacitor is a passive two-terminal electrical component used to store electrical energy temporarily in an electric field.; PROD_ID: CAP-11625; VALUE: 1.0uF
C9 C11 C13 C15 C17 C19 C21 C22 C24 C27 C29 = SparkFun-Capacitors:1.0UF: 1µF ceramic capacitors A capacitor is a passive two-terminal electrical component used to store electrical energy temporarily in an electric field.; PROD_ID: CAP-11625
CLOCKCTRL_0 CLOCKCTRL_1 CLOCKCTRL_2 PLL_CLK_OUT2 SYS_CLK = SamacSys_Parts:2985-6004: RF Connectors / Coaxial Connectors SMA F PCB Thru-Hole Conn, 50-OHMS 1000 Source: Datasheet <https://componentsearchengine.com//2985-6004.pdf>; DESCRIPTION: RF Connectors / Coaxial Connectors SMA F PCB Thru-Hole Conn, 50-OHMS 1000; HEIGHT: 9.54mm; MANUFACTURER_NAME: Amphenol; MANUFACTURER_PART_NUMBER: 2985-6004; MOUSER_PART_NUMBER: 523-2985-6004; MOUSER_PRICE-STOCK: https://www.mouser.co.uk/ProductDetail/Amphenol-SV-Microwave/2985-6004?qs=jyo2EwfRkUNkt8LGijRXFQ%3D%3D
FLASH_CONNECTOR SDCARD_CONNECTOR = Connector:PINHD-2X6: PIN HEADER; CATEGORY: CONNECTOR; SUB-CATEGORY: PIN-HEADER
GPIO_0 GPIO_1-GPIO_3 = pinhead:PINHD-2X20: PIN HEADER
H1-H6 = holes:MOUNT-HOLE: MOUNTING HOLE with drill center marker
IC1 IC2 IC4 IC6 = SamacSys_Parts:TXB0108PWR: 8-Bit Bidirectional Voltage-Level Shifter with Auto Direction Sensing and +/-15-kV ESD Protect Source: Datasheet <http://www.ti.com/lit/ds/symlink/txb0108.pdf>; ARROW_PART_NUMBER: TXB0108PWR; ARROW_PRICE-STOCK: https://www.arrow.com/en/products/txb0108pwr/texas-instruments?region=nac; DESCRIPTION: 8-Bit Bidirectional Voltage-Level Shifter with Auto Direction Sensing and +/-15-kV ESD Protect; HEIGHT: 1.2mm; MANUFACTURER_NAME: Texas Instruments; MANUFACTURER_PART_NUMBER: TXB0108PWR; MOUSER_PART_NUMBER: 595-TXB0108PWR; MOUSER_PRICE-STOCK: https://www.mouser.co.uk/ProductDetail/Texas-Instruments/TXB0108PWR?qs=oFXvjAmG9EgEUWGWzOVFCA%3D%3D
IC3 IC5 IC7 = SamacSys_Parts:TPS76201DBVR: Reg LDO Lin Adj Pos 0.7V to 5.5V 0.1A Texas Instruments TPS76201DBVR, LDO Voltage Regulator, Adjustable 0.1A, 0.7 ??? 5.5 V, 5-Pin SOT-23 Source: Datasheet <https://datasheet.datasheetarchive.com/originals/distributors/Datasheets-302/23154.pdf>; ARROW_PART_NUMBER: TPS76201DBVR; ARROW_PRICE-STOCK: https://www.arrow.com/en/products/tps76201dbvr/texas-instruments; DESCRIPTION: Reg LDO Lin Adj Pos 0.7V to 5.5V 0.1A Texas Instruments TPS76201DBVR, LDO Voltage Regulator, Adjustable 0.1A, 0.7 ??? 5.5 V, 5-Pin SOT-23; HEIGHT: 1.45mm; MANUFACTURER_NAME: Texas Instruments; MANUFACTURER_PART_NUMBER: TPS76201DBVR; MOUSER_PART_NUMBER: 595-TPS76201DBVR; MOUSER_PRICE-STOCK: https://www.mouser.co.uk/ProductDetail/Texas-Instruments/TPS76201DBVR?qs=xJkDX%2FqrskNr%252BnYlk%252B9fUg%3D%3D
JP1 LED = pinhead:PINHD-2X16: PIN HEADER
JTAG RESET SDCARD = pinhead:PINHD-2X4: PIN HEADER
JTAG_CONNECTOR = pinhead:PINHD-2X10: PIN HEADER
LED1-LED21 = adafruit:LED: LED OSRAM: - CHIPLED LG R971, LG N971, LY N971, LG Q971, LY Q971, LO R971, LY R971 LH N974, LH R974 LS Q976, LO Q976, LY Q976 LO Q996 - Hyper CHIPLED LW Q18S LB Q993, LB Q99A, LB R99A - SideLED LS A670, LO A670, LY A670, LG A670, LP A670 LB A673, LV A673, LT A673, LW A673 LH A674 LY A675 LS A676, LA A676, LO A676, LY A676, LW A676 LS A679, LY A679, LG A679 - Hyper Micro SIDELED® LS Y876, LA Y876, LO Y876, LY Y876 LT Y87S - SmartLED LW L88C, LW L88S LB L89C, LB L89S, LG L890 LS L89K, LO L89K, LY L89K LS L896, LA L896, LO L896, LY L896 - TOPLED LS T670, LO T670, LY T670, LG T670, LP T670 LSG T670, LSP T670, LSY T670, LOP T670, LYG T670 LG T671, LOG T671, LSG T671 LB T673, LV T673, LT T673, LW T673 LH T674 LS T676, LA T676, LO T676, LY T676, LB T676, LH T676, LSB T676, LW T676 LB T67C, LV T67C, LT T67C, LS T67K, LO T67K, LY T67K, LW E67C LS E67B, LA E67B, LO E67B, LY E67B, LB E67C, LV E67C, LT E67C LW T67C LS T679, LY T679, LG T679 LS T770, LO T770, LY T770, LG T770, LP T770 LB T773, LV T773, LT T773, LW T773 LH T774 LS E675, LA E675, LY E675, LS T675 LS T776, LA T776, LO T776, LY T776, LB T776 LHGB T686 LT T68C, LB T68C - Hyper Mini TOPLED® LB M676 - Mini TOPLED Santana® LG M470 LS M47K, LO M47K, LY M47K Source: http://www.osram.convergy.de/
POWER QSPI = pinhead:PINHD-2X6: PIN HEADER
Q1-Q21 = SamacSys_Parts:BSH103,235: MOSFET TAPE13 MOSFET Source: Datasheet <http://www.nxp.com/documents/data_sheet/BSH103.pdf>; DESCRIPTION: MOSFET TAPE13 MOSFET; HEIGHT: 1.1mm; MANUFACTURER_NAME: Nexperia; MANUFACTURER_PART_NUMBER: BSH103,235; MOUSER_PART_NUMBER: 771-BSH103235; MOUSER_PRICE-STOCK: https://www.mouser.co.uk/ProductDetail/Nexperia/BSH103235?qs=me8TqzrmIYVhbJIwsR7ziw%3D%3D
R1-R69 = SparkFun-Resistors:0.3OHM: 0.3Ω resistor A resistor is a passive two-terminal electrical component that implements electrical resistance as a circuit element. Resistors act to reduce current flow, and, at the same time, act to lower voltage levels within circuits. - Wikipedia; PROD_ID: RES-11622; VALUE: 0.3
S1 S2 = SamacSys_Parts:219-8LPST: DIP Switches / SIP Switches SPST 8 switch sections Source: Datasheet <https://www.ctscorp.com/wp-content/uploads/219.pdf>; ARROW_PART_NUMBER: 219-8LPST; ARROW_PRICE-STOCK: https://www.arrow.com/en/products/219-8lpst/cts; DESCRIPTION: DIP Switches / SIP Switches SPST 8 switch sections; HEIGHT: 4.2mm; MANUFACTURER_NAME: CTS; MANUFACTURER_PART_NUMBER: 219-8LPST; MOUSER_PART_NUMBER: 774-2198LPST; MOUSER_PRICE-STOCK: https://www.mouser.co.uk/ProductDetail/CTS-Electronic-Components/219-8LPST?qs=qNzHFtQhdJ%252BArk7b%252BY2Vjw%3D%3D
S17 S18 = SamacSys_Parts:SS12SDP2: Switch, Slide,Sub Miniature,Top Actuated,SPDT, On-none-On Source: Datasheet; DESCRIPTION: Switch, Slide,Sub Miniature,Top Actuated,SPDT, On-none-On; HEIGHT: 4mm; MANUFACTURER_NAME: NKK Switches; MANUFACTURER_PART_NUMBER: SS12SDP2; MOUSER_PART_NUMBER: 633-SS12SDP2; MOUSER_PRICE-STOCK: https://www.mouser.co.uk/ProductDetail/NKK-Switches/SS12SDP2?qs=Av7JdS0MGqKsG%252BWOKKtU2w%3D%3D
U$1-U$4 = Duy:2X41_HEADER
UART = Connector:PINHD-2X2: PIN HEADER; CATEGORY: CONNECTOR; SUB-CATEGORY: PIN-HEADER
USB-UART_1 USB-UART_2 = Connector:PINHD-1X4: PIN HEADER; CATEGORY: CONNECTOR; SUB-CATEGORY: PIN-HEADER
VDD VDD_3V3 VDDO = pinhead:PINHD-2X2: PIN HEADER